# EAGLE schematic L002 - Square - Schematic (EAGLE 7.7.0)
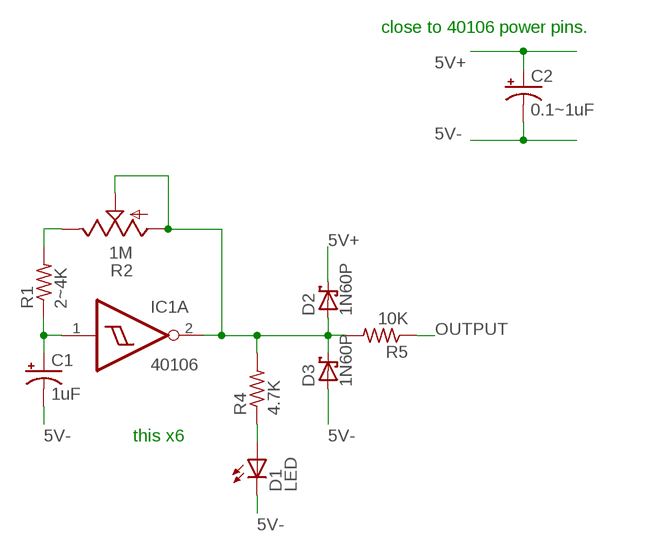
[diagram p0: schematic, sheet 1]

## Parts
C1  1uF  CPOL-USE2.5-6  [E2,5-6]
C2  0.1~1uF  CPOL-USE2.5-6  [E2,5-6]
D1  LED  SFH482  [SFH482]
D2  1N60P  1N5817-B  [DO41-7.6]
D3  1N60P  1N5817-B  [DO41-7.6]
IC1  40106  40106N  [DIL14]
R1  2~4K  R-US_VMTA55  [VMTA55]
R2  1M  US-EVUF3M  [EVUFXM]
R4  4.7K  R-US_VMTA55  [VMTA55]
R5  10K  R-US_VMTA55  [VMTA55]

## Nets
5V+: C2.+ D2.C
5V-: C1.- C2.- D1.K(C) D3.A
N$1: C1.+ IC1.1(A:I) R1.1
N$2: R1.2 R2.3(E)
N$3: D1.A R4.1
OUTPUT: D2.A D3.C IC1.2(A:O) R2.1(A) R2.2(S) R4.2 R5.1 R5.2
Unconnected: IC1.3(B:I) IC1.4(B:O) IC1.5(C:I) IC1.6(C:O) IC1.8(D:O) IC1.9(D:I) IC1.10(E:O) IC1.11(E:I) IC1.12(F:O) IC1.13(F:I)

## Notes on the sheet
- close to 40106 power pins.
- this x6

## Power pins joined to a net without a drawn wire
VDD: IC1.14(P:VDD)
VSS: IC1.7(P:VSS)

## Library data of the parts
C1 C2 = rcl:CPOL-US: POLARIZED CAPACITOR, American symbol
D1 = led:SFH482: IR LED infrared emitting diode, Infineon
D2 D3 = diode:1N581*: 1.0A SCHOTTKY BARRIER RECTIFIER Source: http://www.diodes.com/datasheets/ds23001.pdf
IC1 = 40xx:40106: Hex SCHMITT TRIGGER
R1 R4 R5 = resistor:R-US_: RESISTOR, American symbol
R2 = pot:US-EVU: 9 mm Square Rotary Potentiometers Source: Panasonic